# Altium schematic sheet SH-03225-V0.5.SchDoc
size 420 x 594 mm; SheetNumber: 1; SheetTotal: 1
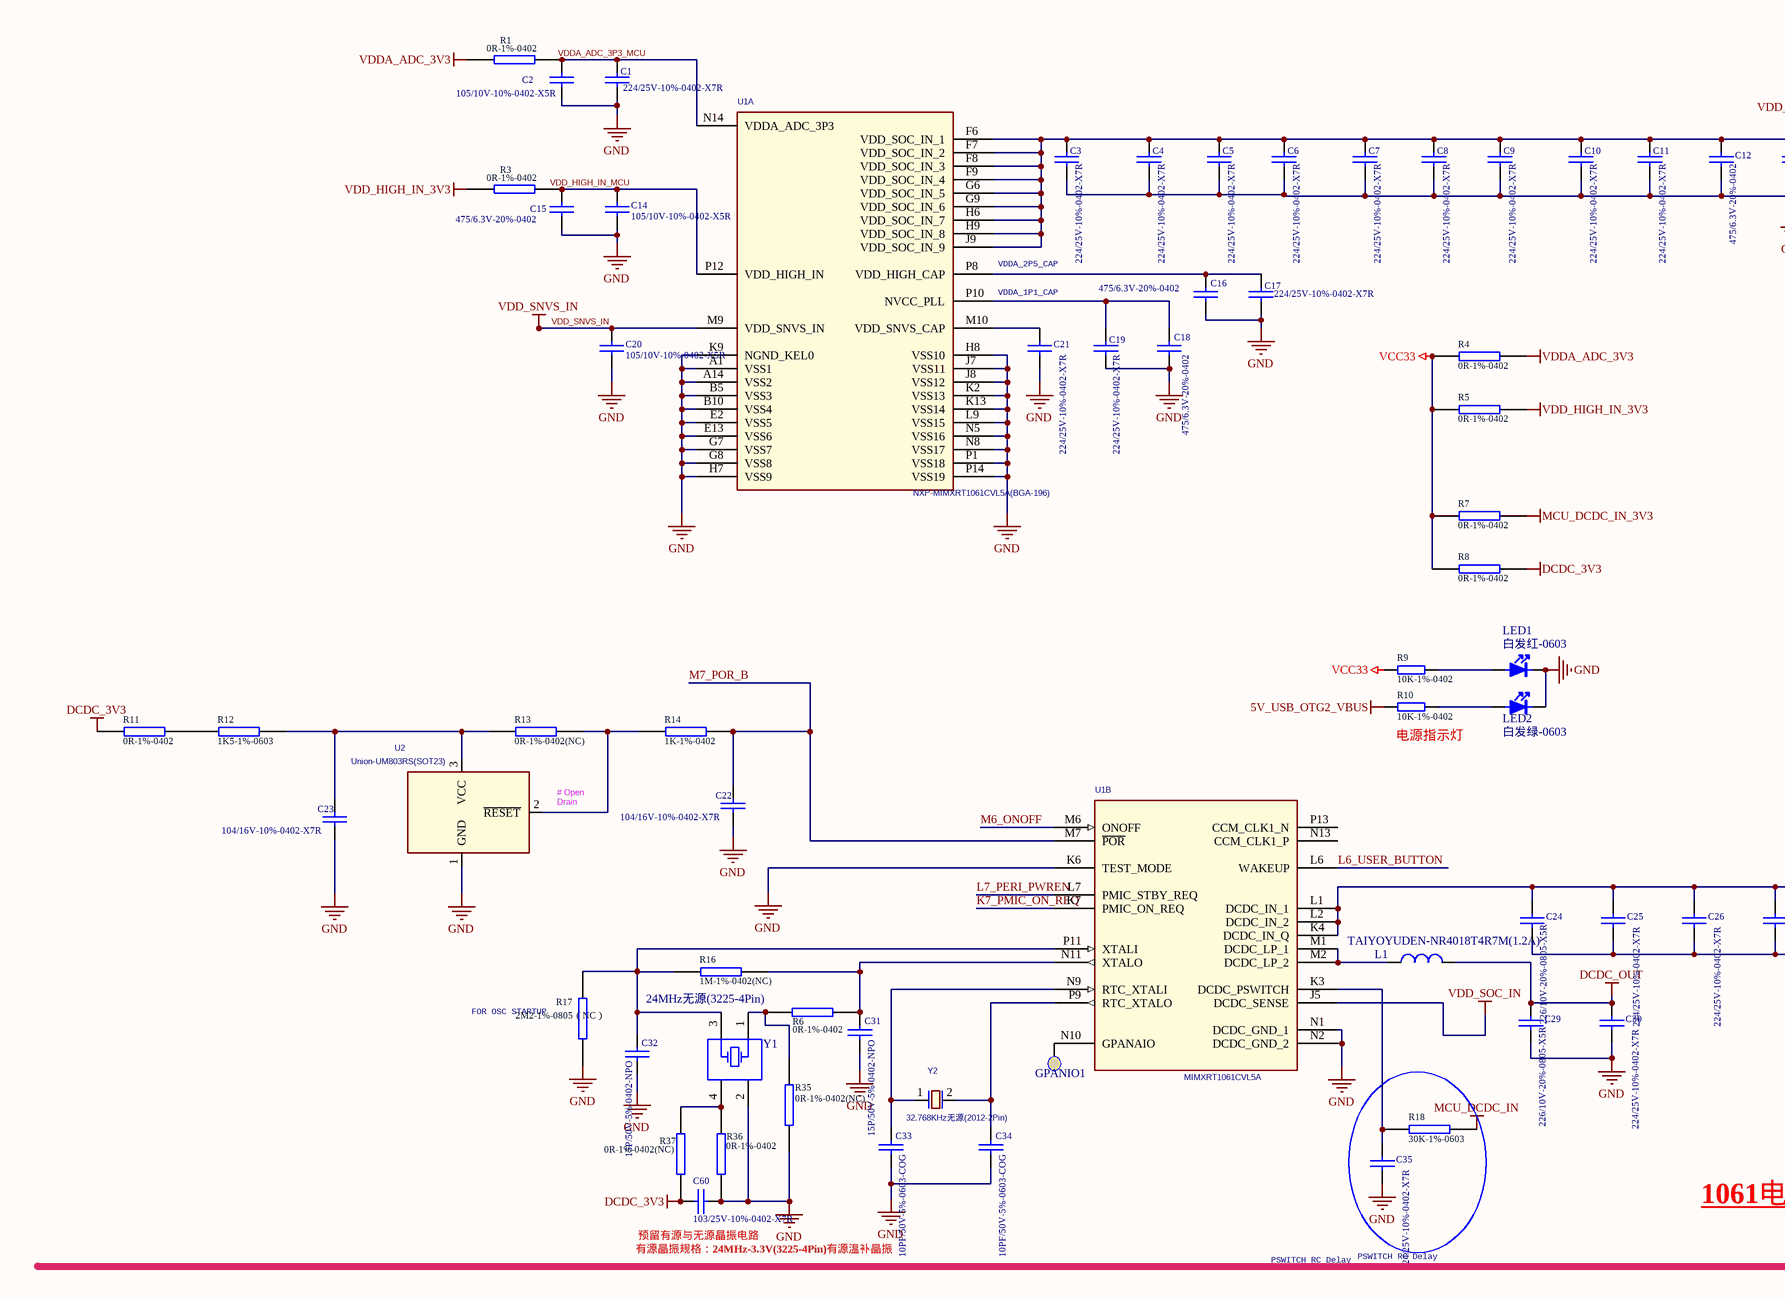
[diagram p0: SH-03225-V0.5.SchDoc, top left]
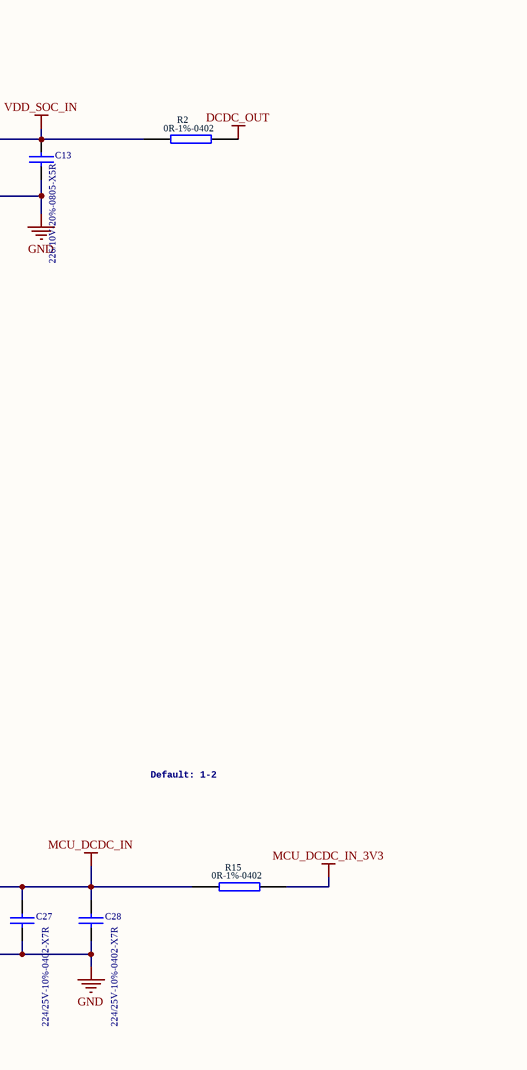
[diagram p1: SH-03225-V0.5.SchDoc, top middle]
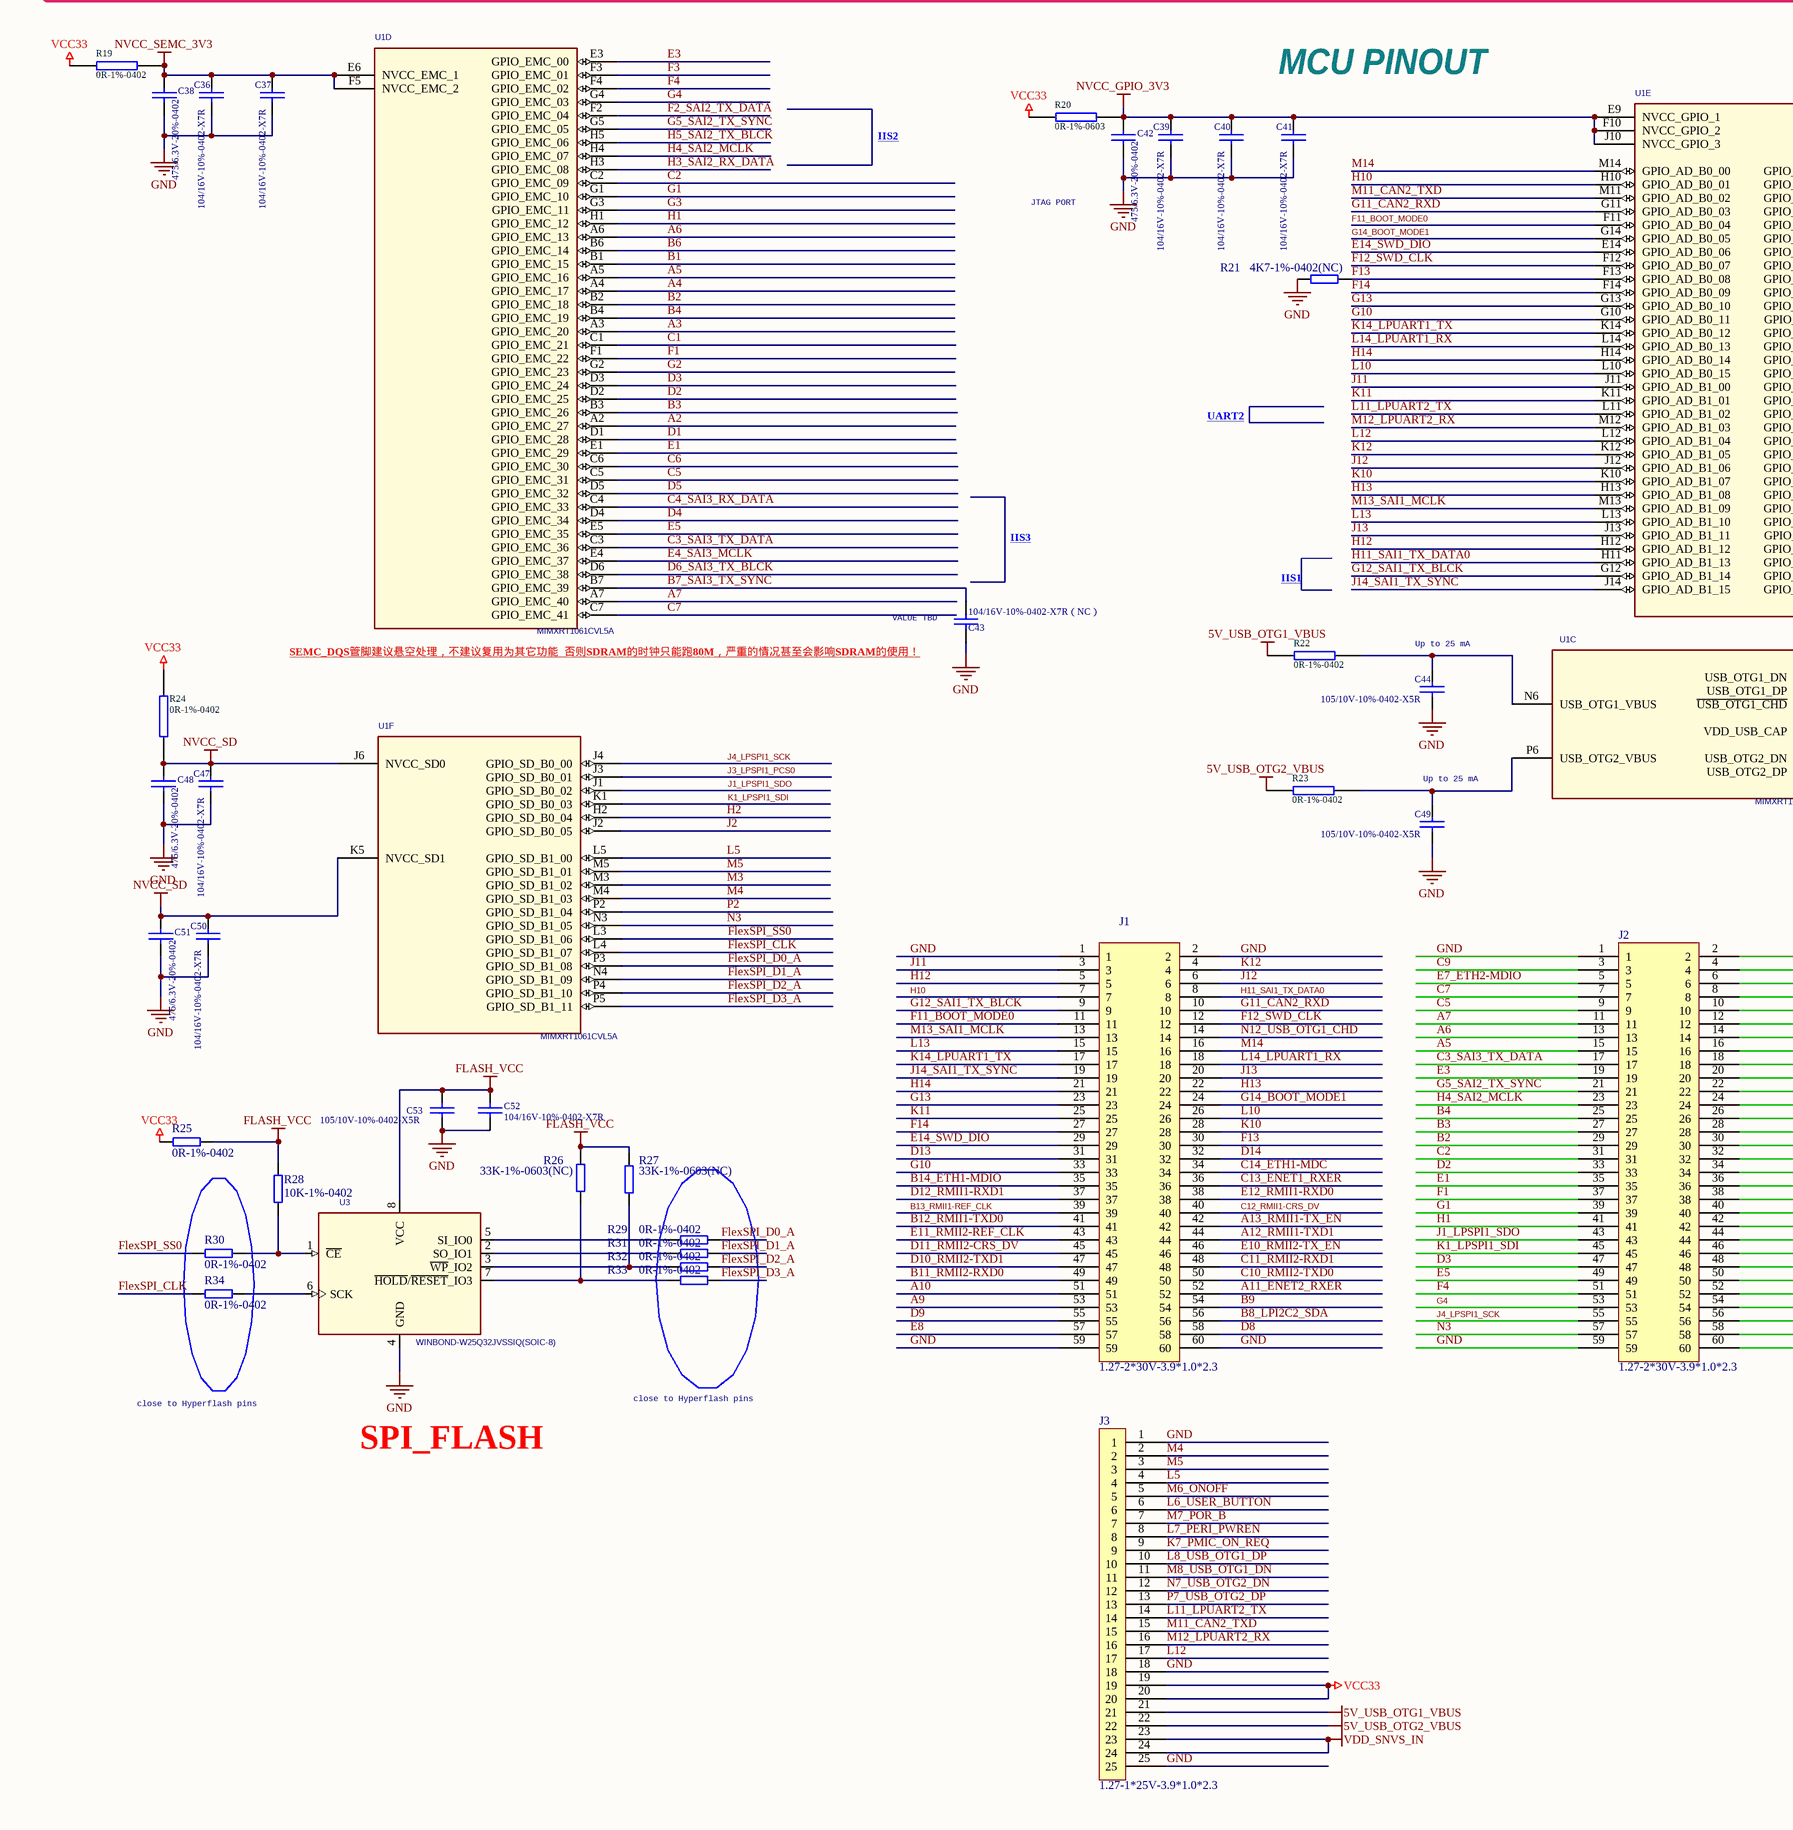
[diagram p2: SH-03225-V0.5.SchDoc, bottom left]
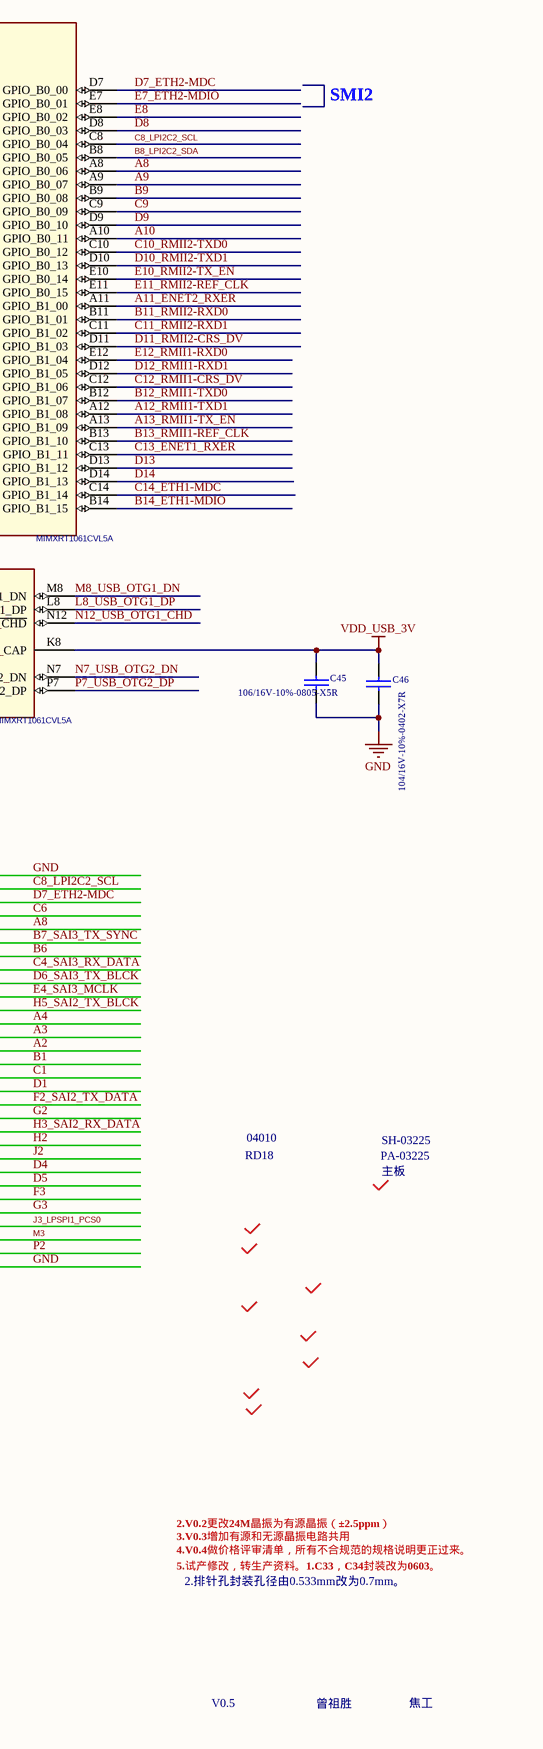
[diagram p3: SH-03225-V0.5.SchDoc, bottom middle]
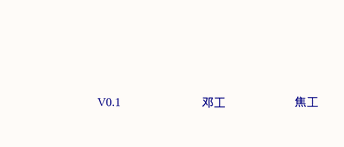
[diagram p4: SH-03225-V0.5.SchDoc, bottom right]

## Parts
C1  224/25V-10%-0402-X7R  [BL-C0402]
C2  105/10V-10%-0402-X5R  [BL-C0402]
C3  224/25V-10%-0402-X7R  [BL-C0402]
C4  224/25V-10%-0402-X7R  [BL-C0402]
C5  224/25V-10%-0402-X7R  [BL-C0402]
C6  224/25V-10%-0402-X7R  [BL-C0402]
C7  224/25V-10%-0402-X7R  [BL-C0402]
C8  224/25V-10%-0402-X7R  [BL-C0402]
C9  224/25V-10%-0402-X7R  [BL-C0402]
C10  224/25V-10%-0402-X7R  [BL-C0402]
C11  224/25V-10%-0402-X7R  [BL-C0402]
C12  475/6.3V-20%-0402  [BL-C0402]
C13  226/10V-20%-0805-X5R  [BL-C0805]
C14  105/10V-10%-0402-X5R  [BL-C0402]
C15  475/6.3V-20%-0402  [BL-C0402]
C16  475/6.3V-20%-0402  [BL-C0402]
C17  224/25V-10%-0402-X7R  [BL-C0402]
C18  475/6.3V-20%-0402  [BL-C0402]
C19  224/25V-10%-0402-X7R  [BL-C0402]
C20  105/10V-10%-0402-X5R  [BL-C0402]
C21  224/25V-10%-0402-X7R  [BL-C0402]
C22  104/16V-10%-0402-X7R  [BL-C0402]
C23  104/16V-10%-0402-X7R  [BL-C0402]
C24  226/10V-20%-0805-X5R  [BL-C0805]
C25  224/25V-10%-0402-X7R  [BL-C0402]
C26  224/25V-10%-0402-X7R  [BL-C0402]
C27  224/25V-10%-0402-X7R  [BL-C0402]
C28  224/25V-10%-0402-X7R  [BL-C0402]
C29  226/10V-20%-0805-X5R  [BL-C0805]
C30  224/25V-10%-0402-X7R  [BL-C0402]
C31  15P/50V-5%-0402-NPO  [BL-C0402]
C32  15P/50V-5%-0402-NPO  [BL-C0402]
C33  10PF/50V-5%-0603-COG  [BL-C0603]
C34  10PF/50V-5%-0603-COG  [BL-C0603]
C35  224/25V-10%-0402-X7R  [BL-C0402]
C36  104/16V-10%-0402-X7R  [BL-C0402]
C37  104/16V-10%-0402-X7R  [BL-C0402]
C38  475/6.3V-20%-0402  [BL-C0402]
C39  104/16V-10%-0402-X7R  [BL-C0402]
C40  104/16V-10%-0402-X7R  [BL-C0402]
C41  104/16V-10%-0402-X7R  [BL-C0402]
C42  475/6.3V-20%-0402  [BL-C0402]
C43  104/16V-10%-0402-X7R（NC）  [BL-C0402]
C44  105/10V-10%-0402-X5R  [BL-C0402]
C45  106/16V-10%-0805-X5R  [BL-C0805]
C46  104/16V-10%-0402-X7R  [BL-C0402]
C47  104/16V-10%-0402-X7R  [BL-C0402]
C48  475/6.3V-20%-0402  [BL-C0402]
C49  105/10V-10%-0402-X5R  [BL-C0402]
C50  104/16V-10%-0402-X7R  [BL-C0402]
C51  475/6.3V-20%-0402  [BL-C0402]
C52  104/16V-10%-0402-X7R  [BL-C0402]
C53  105/10V-10%-0402-X5R  [BL-C0402]
C60  103/25V-10%-0402-X7R  [BL-C0402]
GPANIO1  测试点  [TP-1.0MM]  (value not drawn)
J1  1.27-2*30V-3.9*1.0*2.3  [BL-1.27-2*30V-4.3*2.8-07]
J2  1.27-2*30V-3.9*1.0*2.3  [BL-1.27-2*30V-4.3*2.8-07]
J3  1.27-1*25V-3.9*1.0*2.3  [BL-1.27-1*25V]
L1  TAIYOYUDEN-NR4018T4R7M(1.2A)  [BL-NR4018T4R7M]
LED1  白发红-0603  [BL-LED-0603]
LED2  白发绿-0603  [BL-LED-0603]
R1  0R-1%-0402  [BL-R0402]
R2  0R-1%-0402  [BL-R0402]
R3  0R-1%-0402  [BL-R0402]
R4  0R-1%-0402  [BL-R0402]
R5  0R-1%-0402  [BL-R0402]
R6  0R-1%-0402  [BL-R0402]
R7  0R-1%-0402  [BL-R0402]
R8  0R-1%-0402  [BL-R0402]
R9  10K-1%-0402  [BL-R0402]
R10  10K-1%-0402  [BL-R0402]
R11  0R-1%-0402  [BL-R0402]
R12  1K5-1%-0603  [BL-R0603]
R13  0R-1%-0402(NC)  [BL-R0402]
R14  1K-1%-0402  [BL-R0402]
R15  0R-1%-0402  [BL-R0402]
R16  1M-1%-0402(NC)  [BL-R0805]
R17  2M2-1%-0805（NC）  [BL-R0805]
R18  30K-1%-0603  [BL-R0603]
R19  0R-1%-0402  [BL-R0402]
R20  0R-1%-0603  [BL-R0603]
R21  4K7-1%-0402(NC)  [BL-R0402]
R22  0R-1%-0402  [BL-R0402]
R23  0R-1%-0402  [BL-R0402]
R24  0R-1%-0402  [BL-R0402]
R25  0R-1%-0402  [BL-R0402]
R26  33K-1%-0603(NC)  [BL-R0603]
R27  33K-1%-0603(NC)  [BL-R0603]
R28  10K-1%-0402  [BL-R0402]
R29  0R-1%-0402  [BL-R0402]
R30  0R-1%-0402  [BL-R0402]
R31  0R-1%-0402  [BL-R0402]
R32  0R-1%-0402  [BL-R0402]
R33  0R-1%-0402  [BL-R0402]
R34  0R-1%-0402  [BL-R0402]
R35  0R-1%-0402(NC)  [BL-R0402]
R36  0R-1%-0402  [BL-R0402]
R37  0R-1%-0402(NC)  [BL-R0402]
U1  NXP-MIMXRT1061CVL5A(BGA-196)  [MAPBGA196/0.65/10X10]  (parts A,B,C,D,E,F of 6)
U2  Union-UM803RS(SOT23)  [SOT-23-3]
U3  WINBOND-W25Q32JVSSIQ(SOIC-8)  [SOIC8/1.27/8]
Y1  24MHz无源(3225-4Pin)  [BL-3225-4Pin]
Y2  32.768KHz无源(2012-2Pin)  [BL-2012-2Pin]

## Nets
5V_USB_OTG1_VBUS: J3.21 R22.1
5V_USB_OTG2_VBUS: J3.22 R10.1 R23.1
DCDC_3V3: C60.1 R8.2 R11.1 R37.2
DCDC_OUT: C29.2 C30.1 L1.2 R2.2
FLASH_VCC: C52.2 C53.2 R25.2 R26.1 R27.1 R28.1 U3.8(VCC)
GND: C1.2 C2.2 C3.2 C4.2 C5.2 C6.2 C7.2 C8.2 C9.2 C10.2 C11.2 C12.1 C13.1 C14.1 C15.2 C16.1 C17.2 C18.1 C19.2 C20.1 C21.2 C22.1 C23.1 C24.1 C25.2 C26.2 C27.2 C28.2 C29.1 C30.2 C31.1 C32.1 C33.1 C34.1 C35.2 C36.1 C37.1 C38.1 C39.1 C40.1 C41.1 C42.1 C43.1 C44.1 C45.1 C46.1 C47.1 C48.1 C49.1 C50.1 C51.1 C52.1 C53.1 C60.2 J1.1 J1.2 J1.59 J1.60 J2.1 J2.2 J2.59 J2.60 J3.1 J3.18 J3.25 LED1.2 LED2.2 R17.1 R21.1 R35.1 R36.2 U1.A1(VSS1) U1.A14(VSS2) U1.B5(VSS3) U1.B10(VSS4) U1.E2(VSS5) U1.E13(VSS6) U1.G7(VSS7) U1.G8(VSS8) U1.H7(VSS9) U1.H8(VSS10) U1.J7(VSS11) U1.J8(VSS12) U1.K2(VSS13) U1.K6(TEST_MODE) U1.K9(NGND_KEL0) U1.K13(VSS14) U1.L9(VSS15) U1.N1(DCDC_GND_1) U1.N2(DCDC_GND_2) U1.N5(VSS16) U1.N8(VSS17) U1.P1(VSS18) U1.P14(VSS19) U2.1(GND) U3.4(GND) Y1.2(GND2)
MCU_DCDC_IN: C24.2 C25.1 C26.1 C27.1 C28.1 R15.1 R18.2 U1.K4(DCDC_IN_Q) U1.L1(DCDC_IN_1) U1.L2(DCDC_IN_2)
MCU_DCDC_IN_3V3: R7.2 R15.2
NVCC_GPIO_3V3: C39.2 C40.2 C41.2 C42.2 R20.2 U1.E9(NVCC_GPIO_1) U1.F10(NVCC_GPIO_2) U1.J10(NVCC_GPIO_3)
NVCC_SD: C47.2 C48.2 C50.2 C51.2 R24.1 U1.J6(NVCC_SD0) U1.K5(NVCC_SD1)
NVCC_SEMC_3V3: C36.2 C37.2 C38.2 R19.2 U1.E6(NVCC_EMC_1) U1.F5(NVCC_EMC_2)
VCC33: J3.19 J3.20 R4.1 R5.1 R7.1 R8.1 R9.1 R19.1 R20.1 R24.2 R25.1
VDD_HIGH_IN_3V3: R3.1 R5.2
VDD_SNVS_IN: C20.2 J3.23 J3.24 U1.M9(VDD_SNVS_IN)
VDD_SOC_IN: C3.1 C4.1 C5.1 C6.1 C7.1 C8.1 C9.1 C10.1 C11.1 C12.2 C13.2 R2.1 U1.F6(VDD_SOC_IN_1) U1.F7(VDD_SOC_IN_2) U1.F8(VDD_SOC_IN_3) U1.F9(VDD_SOC_IN_4) U1.G6(VDD_SOC_IN_5) U1.G9(VDD_SOC_IN_6) U1.H6(VDD_SOC_IN_7) U1.H9(VDD_SOC_IN_8) U1.J5(DCDC_SENSE) U1.J9(VDD_SOC_IN_9)
VDD_USB_3V: C45.2 C46.2 U1.K8(VDD_USB_CAP)
VDDA_ADC_3V3: R1.1 R4.2
A2: J2.28 U1.A2(GPIO_EMC_27)
A3: J2.26 U1.A3(GPIO_EMC_20)
A4: J2.24 U1.A4(GPIO_EMC_17)
A5: J2.15 U1.A5(GPIO_EMC_16)
A6: J2.13 U1.A6(GPIO_EMC_13)
A7: J2.11 U1.A7(GPIO_EMC_40)
A8: J2.10 U1.A8(GPIO_B0_06)
A9: J1.53 U1.A9(GPIO_B0_07)
A10: J1.51 U1.A10(GPIO_B0_11)
A11_ENET2_RXER: J1.52 U1.A11(GPIO_B1_00)
A12_RMII1-TXD1: J1.44 U1.A12(GPIO_B1_08)
A13_RMII1-TX_EN: J1.42 U1.A13(GPIO_B1_09)
B1: J2.30 U1.B1(GPIO_EMC_15)
B2: J2.29 U1.B2(GPIO_EMC_18)
B3: J2.27 U1.B3(GPIO_EMC_26)
B4: J2.25 U1.B4(GPIO_EMC_19)
B6: J2.14 U1.B6(GPIO_EMC_14)
B7_SAI3_TX_SYNC: C43.2 J2.12 U1.B7(GPIO_EMC_39)
B8_LPI2C2_SDA: J1.56 U1.B8(GPIO_B0_05)
B9: J1.54 U1.B9(GPIO_B0_08)
B11_RMII2-RXD0: J1.49 U1.B11(GPIO_B1_01)
B12_RMII1-TXD0: J1.41 U1.B12(GPIO_B1_07)
B13_RMII1-REF_CLK: J1.39 U1.B13(GPIO_B1_10)
B14_ETH1-MDIO: J1.35 U1.B14(GPIO_B1_15)
C1: J2.32 U1.C1(GPIO_EMC_21)
C2: J2.31 U1.C2(GPIO_EMC_09)
C3_SAI3_TX_DATA: J2.17 U1.C3(GPIO_EMC_36)
C4_SAI3_RX_DATA: J2.16 U1.C4(GPIO_EMC_33)
C5: J2.9 U1.C5(GPIO_EMC_31)
C6: J2.8 U1.C6(GPIO_EMC_30)
C7: J2.7 U1.C7(GPIO_EMC_41)
C8_LPI2C2_SCL: J2.4 U1.C8(GPIO_B0_04)
C9: J2.3 U1.C9(GPIO_B0_09)
C10_RMII2-TXD0: J1.50 U1.C10(GPIO_B0_12)
C11_RMII2-RXD1: J1.48 U1.C11(GPIO_B1_02)
C12_RMII1-CRS_DV: J1.40 U1.C12(GPIO_B1_06)
C13_ENET1_RXER: J1.36 U1.C13(GPIO_B1_11)
C14_ETH1-MDC: J1.34 U1.C14(GPIO_B1_14)
D1: J2.34 U1.D1(GPIO_EMC_28)
D2: J2.33 U1.D2(GPIO_EMC_25)
D3: J2.47 U1.D3(GPIO_EMC_24)
D4: J2.46 U1.D4(GPIO_EMC_34)
D5: J2.48 U1.D5(GPIO_EMC_32)
D6_SAI3_TX_BLCK: J2.18 U1.D6(GPIO_EMC_38)
D7_ETH2-MDC: J2.6 U1.D7(GPIO_B0_00)
D8: J1.58 U1.D8(GPIO_B0_03)
D9: J1.55 U1.D9(GPIO_B0_10)
D10_RMII2-TXD1: J1.47 U1.D10(GPIO_B0_13)
D11_RMII2-CRS_DV: J1.45 U1.D11(GPIO_B1_03)
D12_RMII1-RXD1: J1.37 U1.D12(GPIO_B1_05)
D13: J1.31 U1.D13(GPIO_B1_12)
D14: J1.32 U1.D14(GPIO_B1_13)
E1: J2.35 U1.E1(GPIO_EMC_29)
E3: J2.19 U1.E3(GPIO_EMC_00)
E4_SAI3_MCLK: J2.20 U1.E4(GPIO_EMC_37)
E5: J2.49 U1.E5(GPIO_EMC_35)
E7_ETH2-MDIO: J2.5 U1.E7(GPIO_B0_01)
E8: J1.57 U1.E8(GPIO_B0_02)
E10_RMII2-TX_EN: J1.46 U1.E10(GPIO_B0_14)
E11_RMII2-REF_CLK: J1.43 U1.E11(GPIO_B0_15)
E12_RMII1-RXD0: J1.38 U1.E12(GPIO_B1_04)
E14_SWD_DIO: J1.29 U1.E14(GPIO_AD_B0_06)
F1: J2.37 U1.F1(GPIO_EMC_22)
F2_SAI2_TX_DATA: J2.36 U1.F2(GPIO_EMC_04)
F3: J2.50 U1.F3(GPIO_EMC_01)
F4: J2.51 U1.F4(GPIO_EMC_02)
F11_BOOT_MODE0: J1.11 U1.F11(GPIO_AD_B0_04)
F12_SWD_CLK: J1.12 U1.F12(GPIO_AD_B0_07)
F13: J1.30 R21.2 U1.F13(GPIO_AD_B0_08)
F14: J1.27 U1.F14(GPIO_AD_B0_09)
FlexSPI_CLK: R34.1 U1.L4(GPIO_SD_B1_07)
FlexSPI_D0_A: R29.2 U1.P3(GPIO_SD_B1_08)
FlexSPI_D1_A: R31.2 U1.N4(GPIO_SD_B1_09)
FlexSPI_D2_A: R32.2 U1.P4(GPIO_SD_B1_10)
FlexSPI_D3_A: R33.2 U1.P5(GPIO_SD_B1_11)
FlexSPI_SS0: R30.1 U1.L3(GPIO_SD_B1_06)
G1: J2.39 U1.G1(GPIO_EMC_10)
G2: J2.38 U1.G2(GPIO_EMC_23)
G3: J2.52 U1.G3(GPIO_EMC_11)
G4: J2.53 U1.G4(GPIO_EMC_03)
G5_SAI2_TX_SYNC: J2.21 U1.G5(GPIO_EMC_05)
G10: J1.33 U1.G10(GPIO_AD_B0_11)
G11_CAN2_RXD: J1.10 U1.G11(GPIO_AD_B0_03)
G12_SAI1_TX_BLCK: J1.9 U1.G12(GPIO_AD_B1_14)
G13: J1.23 U1.G13(GPIO_AD_B0_10)
G14_BOOT_MODE1: J1.24 U1.G14(GPIO_AD_B0_05)
H1: J2.41 U1.H1(GPIO_EMC_12)
H2: J2.42 U1.H2(GPIO_SD_B0_04)
H3_SAI2_RX_DATA: J2.40 U1.H3(GPIO_EMC_08)
H4_SAI2_MCLK: J2.23 U1.H4(GPIO_EMC_07)
H5_SAI2_TX_BLCK: J2.22 U1.H5(GPIO_EMC_06)
H10: J1.7 U1.H10(GPIO_AD_B0_01)
H11_SAI1_TX_DATA0: J1.8 U1.H11(GPIO_AD_B1_13)
H12: J1.5 U1.H12(GPIO_AD_B1_12)
H13: J1.22 U1.H13(GPIO_AD_B1_08)
H14: J1.21 U1.H14(GPIO_AD_B0_14)
J1_LPSPI1_SDO: J2.43 U1.J1(GPIO_SD_B0_02)
J2: J2.44 U1.J2(GPIO_SD_B0_05)
J3_LPSPI1_PCS0: J2.54 U1.J3(GPIO_SD_B0_01)
J4_LPSPI1_SCK: J2.55 U1.J4(GPIO_SD_B0_00)
J11: J1.3 U1.J11(GPIO_AD_B1_00)
J12: J1.6 U1.J12(GPIO_AD_B1_06)
J13: J1.20 U1.J13(GPIO_AD_B1_11)
J14_SAI1_TX_SYNC: J1.19 U1.J14(GPIO_AD_B1_15)
K1_LPSPI1_SDI: J2.45 U1.K1(GPIO_SD_B0_03)
K7_PMIC_ON_REQ: J3.9 U1.K7(PMIC_ON_REQ)
K10: J1.28 U1.K10(GPIO_AD_B1_07)
K11: J1.25 U1.K11(GPIO_AD_B1_01)
K12: J1.4 U1.K12(GPIO_AD_B1_05)
K14_LPUART1_TX: J1.17 U1.K14(GPIO_AD_B0_12)
L5: J3.4 U1.L5(GPIO_SD_B1_00)
L6_USER_BUTTON: J3.6 U1.L6(WAKEUP)
L7_PERI_PWREN: J3.8 U1.L7(PMIC_STBY_REQ)
L8_USB_OTG1_DP: J3.10 U1.L8(USB_OTG1_DP)
L10: J1.26 U1.L10(GPIO_AD_B0_15)
L11_LPUART2_TX: J3.14 U1.L11(GPIO_AD_B1_02)
L12: J3.17 U1.L12(GPIO_AD_B1_04)
L13: J1.15 U1.L13(GPIO_AD_B1_10)
L14_LPUART1_RX: J1.18 U1.L14(GPIO_AD_B0_13)
M3: J2.56 U1.M3(GPIO_SD_B1_02)
M4: J3.2 U1.M4(GPIO_SD_B1_03)
M5: J3.3 U1.M5(GPIO_SD_B1_01)
M6_ONOFF: J3.5 U1.M6(ONOFF)
M7_POR_B: C22.2 J3.7 R14.2 U1.M7(~{POR})
M8_USB_OTG1_DN: J3.11 U1.M8(USB_OTG1_DN)
M11_CAN2_TXD: J3.15 U1.M11(GPIO_AD_B0_02)
M12_LPUART2_RX: J3.16 U1.M12(GPIO_AD_B1_03)
M13_SAI1_MCLK: J1.13 U1.M13(GPIO_AD_B1_09)
M14: J1.16 U1.M14(GPIO_AD_B0_00)
N3: J2.57 U1.N3(GPIO_SD_B1_05)
N7_USB_OTG2_DN: J3.12 U1.N7(USB_OTG2_DN)
N12_USB_OTG1_CHD: J1.14 U1.N12(~{USB_OTG1_CHD})
P2: J2.58 U1.P2(GPIO_SD_B1_04)
P7_USB_OTG2_DP: J3.13 U1.P7(USB_OTG2_DP)
NetC1_1: C1.1 C2.1 R1.2 U1.N14(VDDA_ADC_3P3)
NetC14_2: C14.2 C15.1 R3.2 U1.P12(VDD_HIGH_IN)
NetC16_2: C16.2 C17.1 U1.P8(VDD_HIGH_CAP)
NetC18_2: C18.2 C19.1 U1.P10(NVCC_PLL)
NetC21_1: C21.1 U1.M10(VDD_SNVS_CAP)
NetC23_2: C23.2 R12.2 R13.1 U2.3(VCC)
NetC31_2: C31.2 R6.2 R16.1 U1.N11(XTALO)
NetC32_2: C32.2 R16.2 R17.2 U1.P11(XTALI) Y1.3(OSC2)
NetC33_2: C33.2 U1.N9(RTC_XTALI) Y2.1
NetC34_2: C34.2 U1.P9(RTC_XTALO) Y2.2
NetC35_1: C35.1 R18.1 U1.K3(DCDC_PSWITCH)
NetC44_2: C44.2 R22.2 U1.N6(USB_OTG1_VBUS)
NetC49_2: C49.2 R23.2 U1.P6(USB_OTG2_VBUS)
NetGPANIO1_1: GPANIO1.1 U1.N10(GPANAIO)
NetL1_1: L1.1 U1.M1(DCDC_LP_1) U1.M2(DCDC_LP_2)
NetLED1_1: LED1.1 R9.2
NetLED2_1: LED2.1 R10.2
NetR6_1: R6.1 R35.2 Y1.1(OSC1)
NetR11_2: R11.2 R12.1
NetR13_2: R13.2 R14.1 U2.2(~{RESET})
NetR26_2: R26.2 R33.1 U3.7(~{HOLD}/~{RESET}_IO3)
NetR27_2: R27.2 R32.1 U3.3(~{WP}_IO2)
NetR28_2: R28.2 R30.2 U3.1(~{CE})
NetR29_1: R29.1 U3.5(SI_IO0)
NetR31_1: R31.1 U3.2(SO_IO1)
NetR34_2: R34.2 U3.6(SCK)
NetR36_1: R36.1 R37.1 Y1.4(GND1)

Not connected (* = marked no-connect by the designer): U1 N13(CCM_CLK1_P) P13(CCM_CLK1_N)

## Notes on the sheet
- (near U1) VDDA_2P5_CAP
- VDDA_1P1_CAP
- (near R10) 电源指示灯
- (near U2) # Open
  Drain
- Default: 1-2
- (near R17) FOR OSC STARTUP
- (near C60) 预留有源与无源晶振电路
- 1061电源管理
- (near C60) 有源晶振规格：24MHz-3.3V(3225-4Pin)有源温补晶振
- PSWITCH RC Delay
- MCU PINOUT
- IIS2
- JTAG PORT
- SMI2
- UART2
- IIS3
- IIS1
- (near U1) SEMC_DQS管脚建议悬空处理，不建议复用为其它功能  否则SDRAM的时钟只能跑80M，严重的情况甚至会影响SDRAM的使用！
- (near C43) VALUE TBD
- (near C44) Up to 25 mA
- (near C49) Up to 25 mA
- RD18
- 04010
- PA-03225
- SH-03225
- 主板
- close to Hyperflash pins
- SPI_FLASH
- 2.V0.2更改24M晶振为有源晶振（±2.5ppm）
- 3.V0.3增加有源和无源晶振电路共用
- 4.V0.4做价格评审清单，所有不合规范的规格说明更正过来。
- 5.试产修改，转生产资料。1.C33，C34封装改为0603。
- 2.排针孔封装孔径由0.533mm改为0.7mm。
- V0.5
- 曾祖胜
- 焦工
- V0.1
- 邓工
- Labels drawn without touching a wire or pin: VDD_HIGH_IN_MCU, VDDA_ADC_3P3_MCU
- 项目编号：
- 高新编号：
- EDA要求
- 原理图编号：
- 线路板编号：
- 线路板类型：
- 阻抗控制
- 板层要求
- □
- 6层
- 单面
- 其它＿＿层
- 无要求
- 双面
- 有要求，在图中注明
- 8层
- 4层
- 10层
- 环保要求
- 安规要求
- 不需要
- CCC
- CE
- RoHS
- 1 PCS
- 无
- UL/CSA
- CB
- 2 PCS
- 其它＿＿＿＿
- 3PCS
- GS
- 打样数量
- 打样周期
- 单机用量
- 正常周期
- 20 PCS
- 4 PCS
- 48小时加急
- 5 PCS
- 24小时加急
- 10 PCS
- 单板调试
- 备注：1.请用红色“   ”勾选要求.
- PCBA
- 3 PCS
- 需要
- √
- 1.  V0.1 初始版本
- 版本修订
- 版本:
- 设计:
- 审核:
- 日期:
- 页码:
- /
- 核准:

## Library data of the parts
C1-C53 C60 = CAP: Capacitor
GPANIO1 = TP
J1 J2 = 1.27-2*30V-4.3*2.8
J3 = 1.27-1*25V-4.3*2.8
L1 = L
LED1 LED2 = LED
R1-R37 = RES2
U1 = IMX6_BGA_196P: IC CPU ARM Cortex-M7 600MHZ 1.3V MAPBGA196; SWAP_INFO: (S1+S2+S3+S4+S5+S6); SPLIT_INST: TRUE; AGILE_PN: TMP-WF-33611; MFG_NAME01: NXP SEMICONDUCTORS; MFG_PN01: MIMXRT1062DVL6A; Temp_Range: 0 to +95; PRE_APN: 330-77081; CAD_APPROVED: Yes; CLASS: IC; ROHS: Yes; HEIGHT: 1.52MM
U2 = SGM803_SOT23-3P: IC VOLT MONITOR 2.63V RST VTH 1-5.5V AUTO SOT-23; CAD_APPROVED: Yes; MFG_NAME01: Union Semiconductor, Inc; AGILE_PN: 315-80553; CLASS: IC; HEIGHT: 1.25MM; ROHS: Yes; MFG_PN01: UM803RS
U3 = 25WP_8P: IC MEM FLASH QPI 64Mb 1.65-1.95V SOIC8W; AGILE_PN: 334-77734; MFG_NAME01: ISSI; MFG_PN01: IS25WP064A-JBLE; Temp_Range: -40C to +105C; CAD_APPROVED: Yes; CLASS: IC; ROHS: Yes; HEIGHT: 2.16MM
Y1 = 无源贴片晶振-4P: 贴片晶振
Y2 = CRYSTAL: XTAL 32.768KHZ 7PF 20PPM -- SMT; CLASS: IC; AGILE_PN: 230-78102; MFG_NAME01: EPSON ELECTRONICS; MFG_PN01: FC-135 32.7680KA-AG3; CAD_APPROVED: Yes; ROHS: Yes; HEIGHT: 0.9MM